# EAGLE design filterarduino (EAGLE 9.1.2)
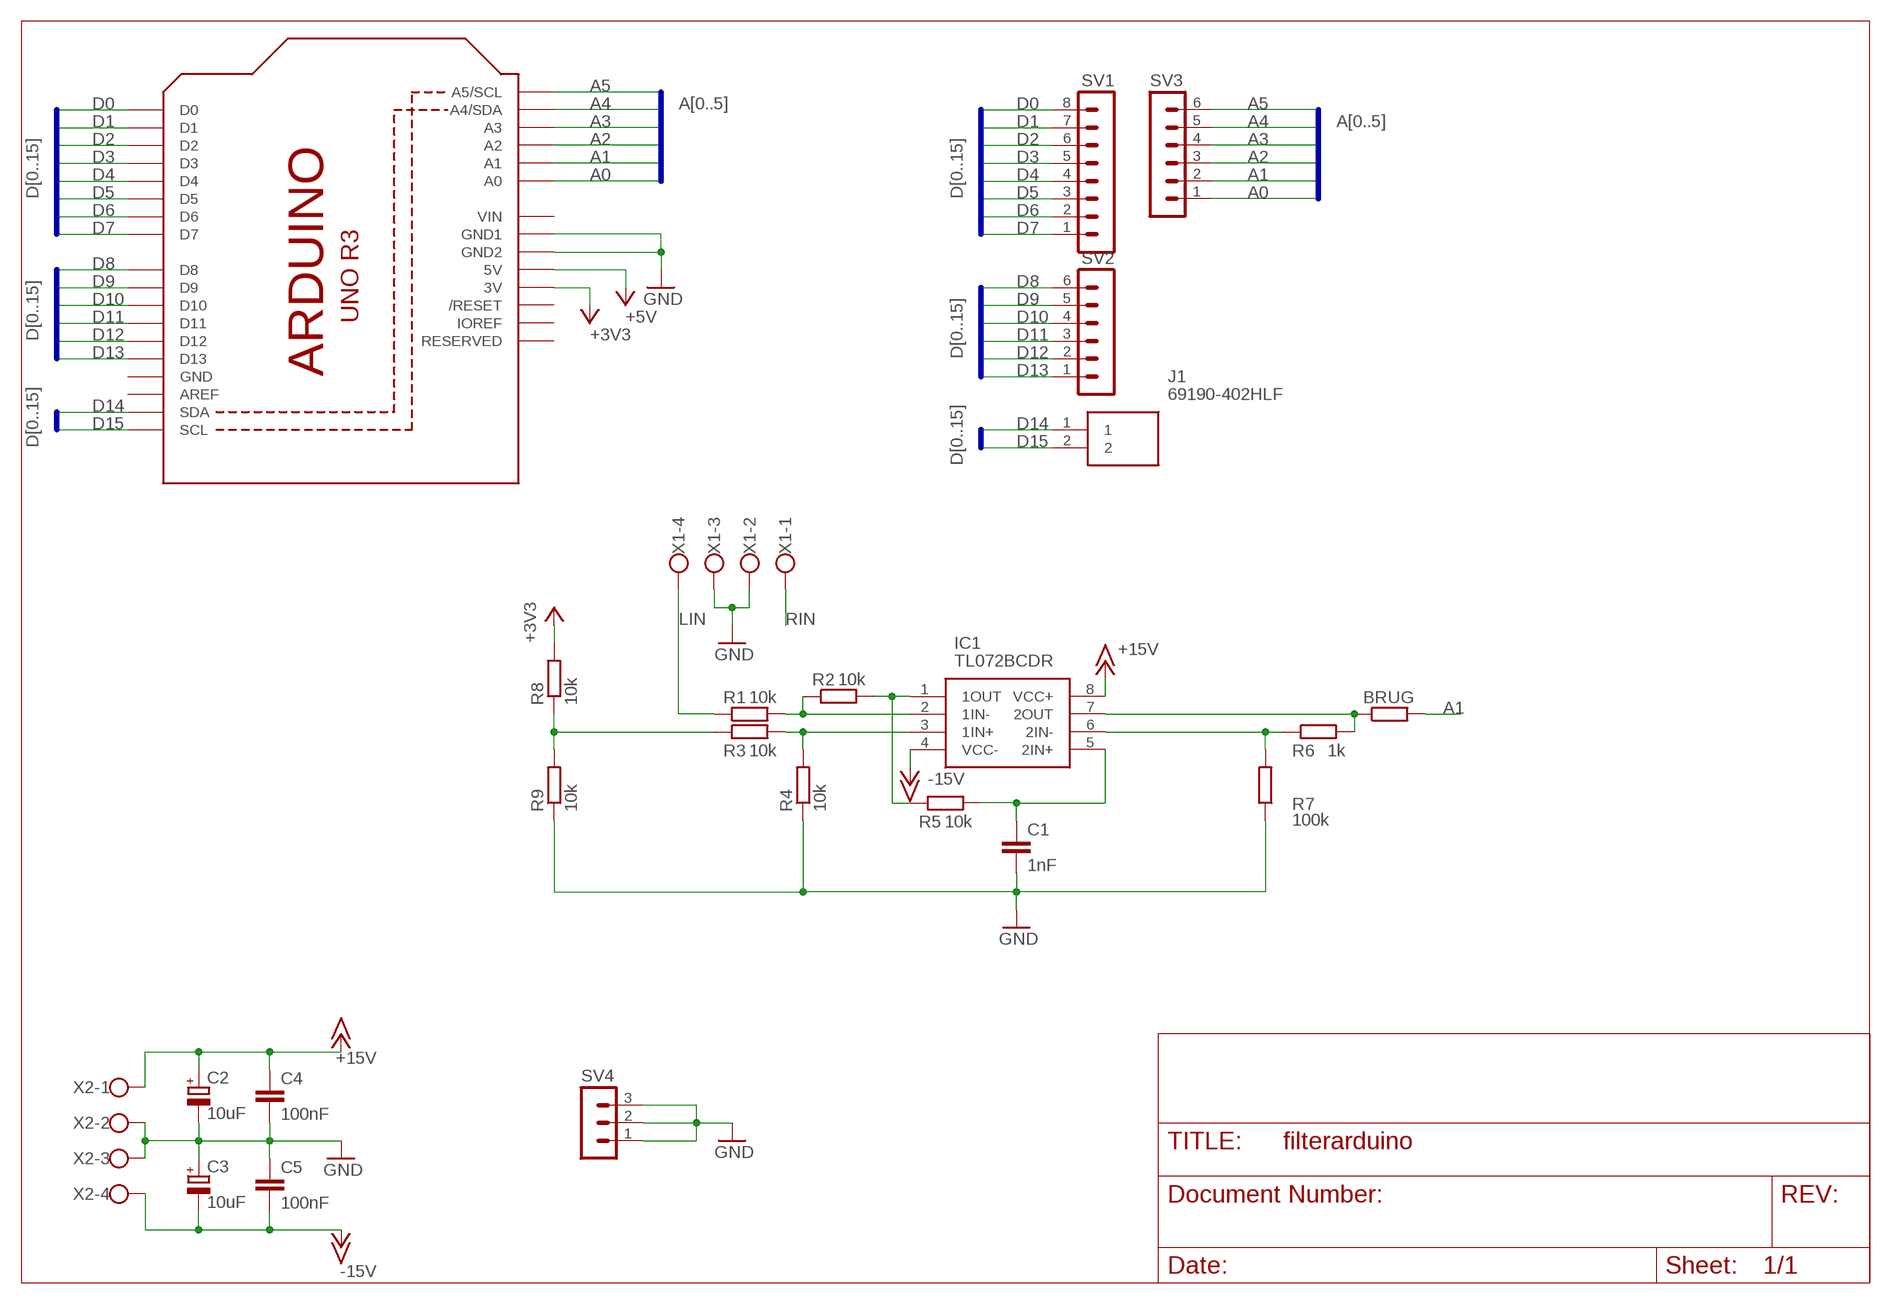
[diagram p0: schematic, sheet 1]

## Parts
BRUG  0  R-EU_R0805  [R0805]
C1  1nF  C-EUC0805  [C0805]
C2  10uF  CPOL-EU153CLV-0505  [153CLV-0505]
C3  10uF  CPOL-EU153CLV-0505  [153CLV-0505]
C4  100nF  C-EUC0805  [C0805]
C5  100nF  C-EUC0805  [C0805]
IC1  TL072BCDR  [SOIC127P600X175-8N]
J1  69190-402HLF  [HDRV2W90P0X254_1X2_508X241X858]
R1  10k  R-EU_R0805  [R0805]
R2  10k  R-EU_R0805  [R0805]
R3  10k  R-EU_R0805  [R0805]
R4  10k  R-EU_R0805  [R0805]
R5  10k  R-EU_R0805  [R0805]
R6  1k  R-EU_R0805  [R0805]
R7  100k  R-EU_R0805  [R0805]
R8  10k  R-EU_R0805  [R0805]
R9  10k  R-EU_R0805  [R0805]
SV1  MA08-1  [MA08-1]
SV2  MA06-1  [MA06-1]
SV3  MA06-1  [MA06-1]
SV4  MA03-1  [MA03-1]
U1  ARDUINOR3-BPLACE  [ARDUINOR3-BPLACE]
X1  W237-4  [W237-4]
X2  W237-4  [W237-4]

## Nets
+3V3: R8.2 U1.3V
+5V: U1.5V
+15V: C2.+ C4.1 IC1.8(VCC+) X2.1
-15V: C3.- C5.2 IC1.4(VCC-) X2.4
A0: SV3.1 U1.A0
A1: BRUG.2 SV3.2 U1.A1
A2: SV3.3 U1.A2
A3: SV3.4 U1.A3
A4: SV3.5 U1.A4(A4/SDA)
A5: SV3.6 U1.A5(A5/SCL)
D0: SV1.8 U1.D0
D1: SV1.7 U1.D1
D2: SV1.6 U1.D2
D3: SV1.5 U1.D3
D4: SV1.4 U1.D4
D5: SV1.3 U1.D5
D6: SV1.2 U1.D6
D7: SV1.1 U1.D7
D8: SV2.6 U1.D8
D9: SV2.5 U1.D9
D10: SV2.4 U1.D10
D11: SV2.3 U1.D11
D12: SV2.2 U1.D12
D13: SV2.1 U1.D13
D14: J1.1 U1.SDA
D15: J1.2 U1.SCL
GND: C1.2 C2.- C3.+ C4.2 C5.1 R4.1 R7.1 R9.1 SV4.1 SV4.2 SV4.3 U1.GND1 U1.GND2 X1.2 X1.3 X2.2 X2.3
LIN: R1.1 X1.4
N$1: IC1.2(1IN-) R1.2 R2.1
N$2: IC1.3(1IN+) R3.2 R4.2
N$3: IC1.1(1OUT) R2.2 R5.2
N$4: C1.1 IC1.5(2IN+) R5.1
N$5: BRUG.1 IC1.7(2OUT) R6.2
N$6: IC1.6(2IN-) R6.1 R7.2
N$9: R3.1 R8.1 R9.2
RIN: X1.1
Unconnected: U1.AREF U1.IOREF U1.RESERVED U1.RESET(/RESET)

## Buses
D[0..15]
A[0..5]

## Power pins joined to a net without a drawn wire
GND: U1.GND
VIN: U1.VIN

## Library data of the parts
BRUG R1-R9 = rcl-vito:R-EU_: RESISTOR, European symbol
C1 C4 C5 = rcl-vito:C-EU: CAPACITOR, European symbol
C2 C3 = rcl-vito:CPOL-EU: POLARIZED CAPACITOR, European symbol
IC1 = TL072BCDR:TL072BCDR: Dual low-noise JFET-input low offset operational amplifier Source: Datasheet <http://www.ti.com/lit/gpn/tl072b>; DESCRIPTION: Dual low-noise JFET-input low offset operational amplifier; HEIGHT: 1.75mm; MANUFACTURER_NAME: Texas Instruments; MANUFACTURER_PART_NUMBER: TL072BCDR; MOUSER_PART_NUMBER: 595-TL072BCDR; MOUSER_PRICE-STOCK: https://www.mouser.co.uk/ProductDetail/Texas-Instruments/TL072BCDR?qs=odmYgEirbwyOLHKvwmd6sw%3D%3D
J1 = 69190-402HLF:69190-402HLF: FCI,Header 2 way unshrouded FCI, Series Number 69190, 2.54mm Pitch 2 Way 1 Row Straight Header, Solder Termination Source: Datasheet <https://cdn.amphenol-icc.com/media/wysiwyg/files/drawing/69190.pdf>; ALLIED_NUMBER: 70302517; ALLIED_PRICE-STOCK: https://www.alliedelec.com/amphenol-fci-69190-402hlf/70302517/; ARROW_PART_NUMBER: 69190-402HLF; ARROW_PRICE-STOCK: https://www.arrow.com/en/products/69190-402hlf/amphenol-fci; DESCRIPTION: FCI,Header 2 way unshrouded FCI, Series Number 69190, 2.54mm Pitch 2 Way 1 Row Straight Header, Solder Termination; HEIGHT: 8.58mm; MANUFACTURER_NAME: FCI; MANUFACTURER_PART_NUMBER: 69190-402HLF; RS_PART_NUMBER: 8632731; RS_PRICE-STOCK: http://uk.rs-online.com/web/p/products/8632731
SV1 = con-lstb:MA08-1: PIN HEADER; OC_FARNELL: unknown; OC_NEWARK: unknown
SV2 SV3 = con-lstb:MA06-1: PIN HEADER; OC_FARNELL: unknown; OC_NEWARK: unknown
SV4 = con-lstb:MA03-1: PIN HEADER; OC_FARNELL: unknown; OC_NEWARK: unknown
U1 = adafruit:ARDUINOR3: This is a new object for the new Arduino R3 - with extra pins that you may want to use (such as IOref, and duplicated A4/A5
X1 X2 = con-wago-500:W237-4: WAGO SCREW CLAMP; OC_FARNELL: unknown; OC_NEWARK: unknown

## Board
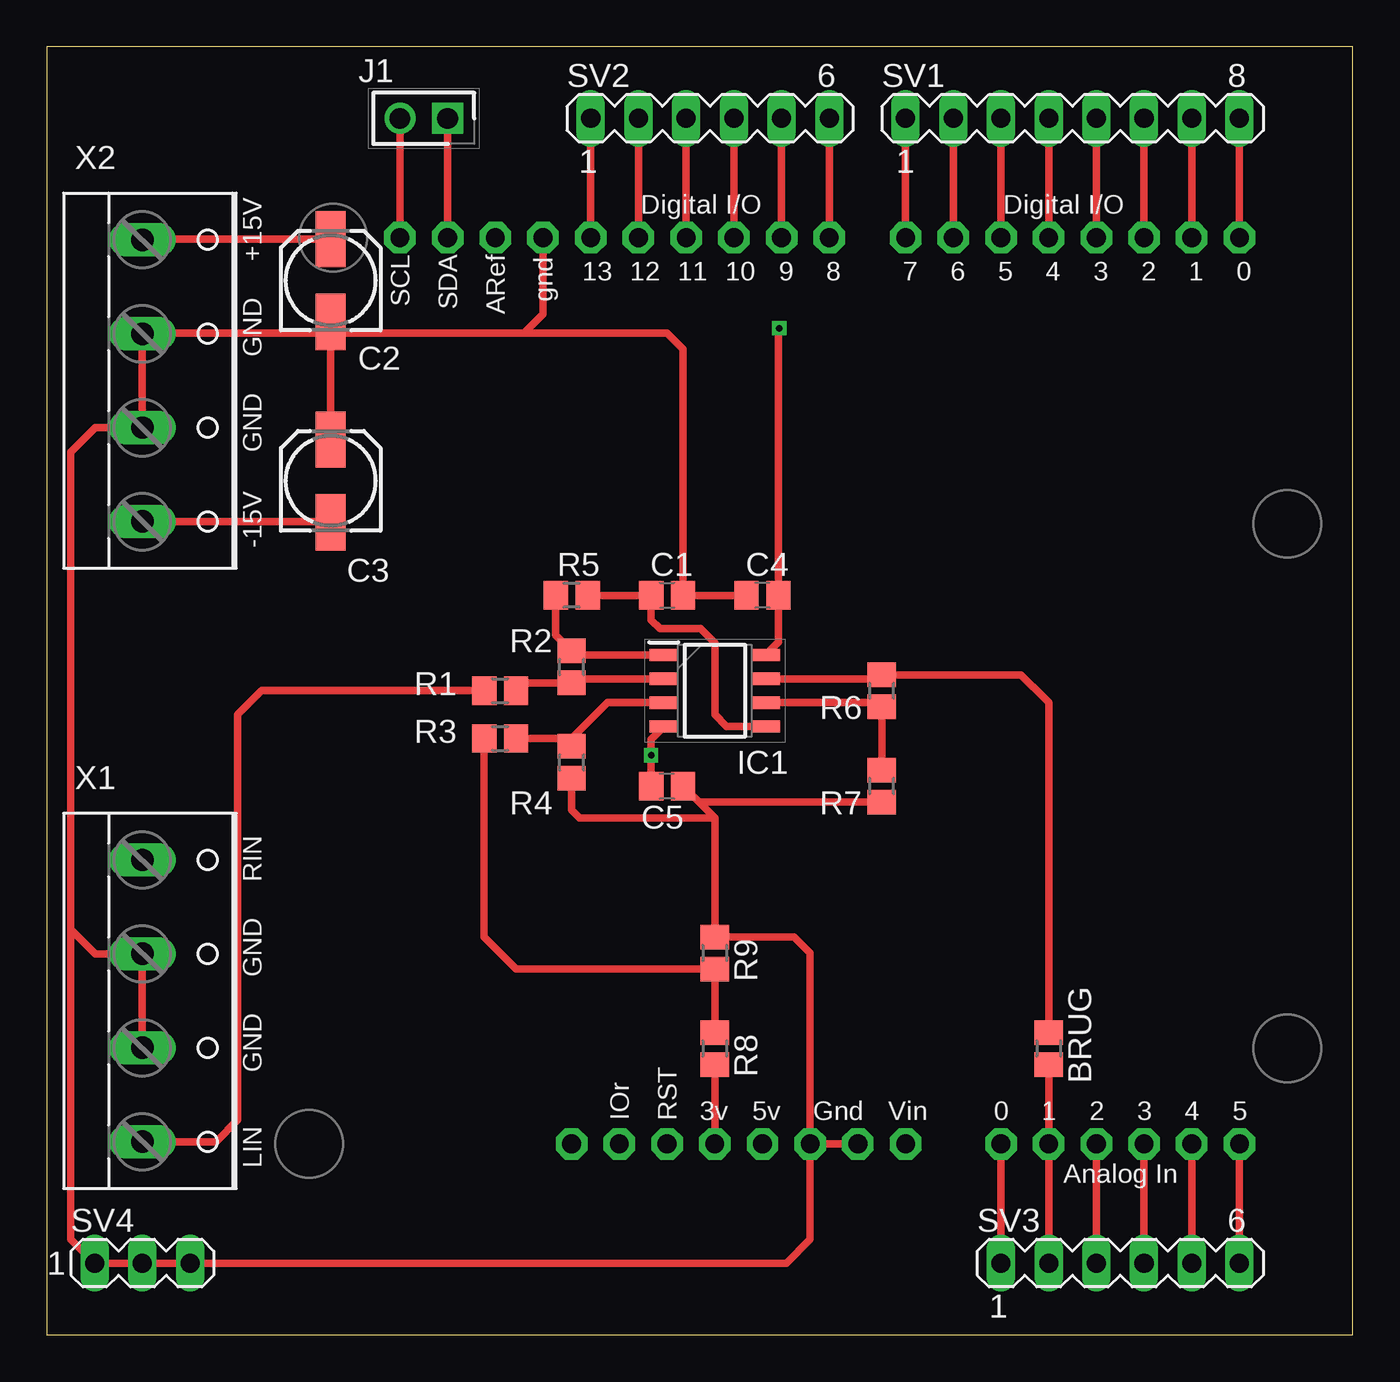
[diagram p1: board, top side]
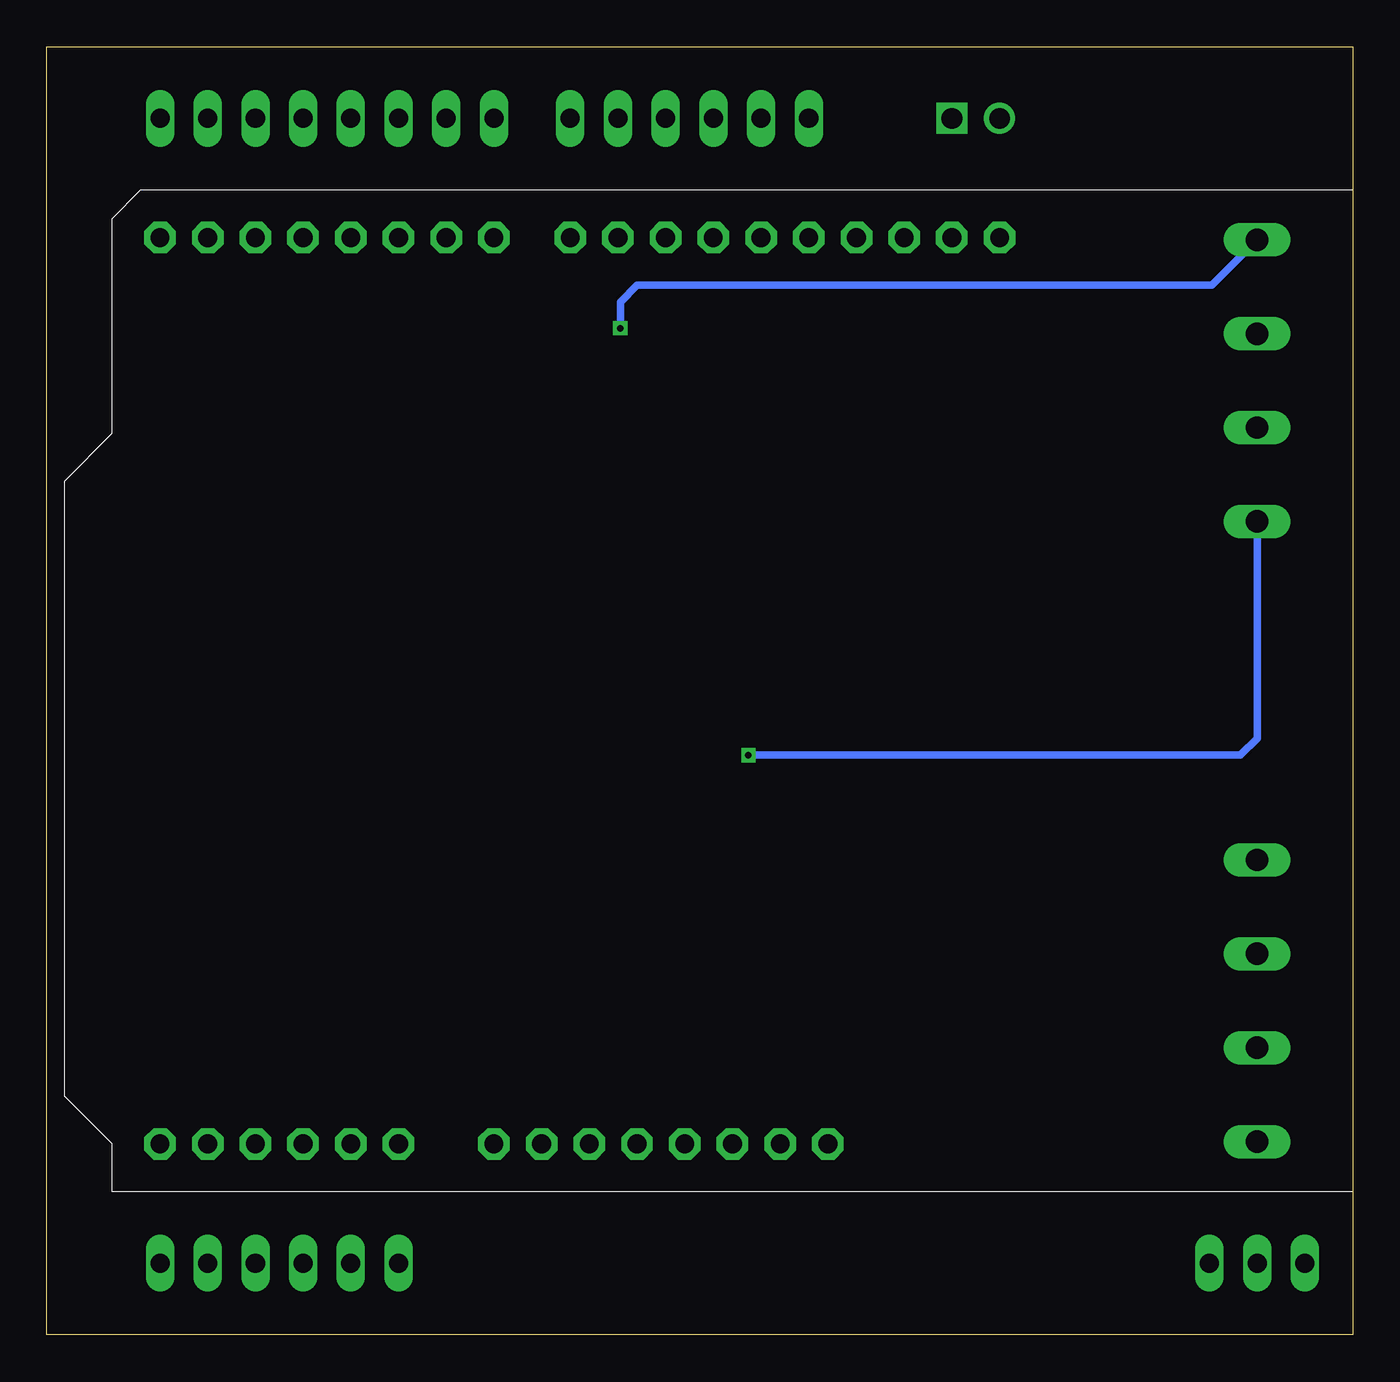
[diagram p2: board, bottom side, seen from below]

Size 69.52 x 68.57 mm. Coordinates in mm from the lower left corner, seen from the top.
Outline: 0,0 69.52,0 69.52,68.57 0,68.57 0,0
Copper layers (1*16): Top 0.035mm / dielectric 1.5mm / Bottom 0.035mm
Design rules "default": minimum track width 6mil, minimum drill 0.35mm, track to track 6mil, track to pad 6mil, pad to pad 6mil, via to via 6mil, smd to smd 6mil, copper to edge 40mil, drill to drill 6mil, minimum pad ring 10mil, minimum via ring 8mil, stop-mask expansion 4mil, vias tented up to drill 0mil, thermal gap 10mil

### Footprints (pad centres in the part's own frame; a part is rotated, then mirrored left to right if it is on the bottom)
R0805 = smd 1.3 x 1.5: 1 -0.85,0; 2 0.85,0
C0805 = smd 1.3 x 1.5: 1 -0.85,0; 2 0.85,0
153CLV-0505 = smd 3 x 1.6: + 2.2,0; - -2.2,0
SOIC127P600X175-8N = smd 1.528 x 0.65: 1 -2.711,1.905; 2 -2.711,0.635; 3 -2.711,-0.635; 4 -2.711,-1.905; 5 2.711,-1.905; 6 2.711,-0.635; 7 2.711,0.635; 8 2.711,1.905
HDRV2W90P0X254_1X2_508X241X858 = drill 1.1 pad 1.65 square: 1 0,0 | drill 1.1 pad 1.65: 2 2.54,0
MA08-1 = drill 1.016 long: 1 -8.89,0; 2 -6.35,0; 3 -3.81,0; 4 -1.27,0; 5 1.27,0; 6 3.81,0; 7 6.35,0; 8 8.89,0
MA06-1 = drill 1.016 long: 1 -6.35,0; 2 -3.81,0; 3 -1.27,0; 4 1.27,0; 5 3.81,0; 6 6.35,0
MA03-1 = drill 1.016 long: 1 -2.54,0; 2 0,0; 3 2.54,0
ARDUINOR3-BPLACE = drill 1 pad 1.676 octagon: 3V 35.56,2.54; 5V 38.1,2.54; A0 50.8,2.54; A1 53.34,2.54; A2 55.88,2.54; A3 58.42,2.54; A4 60.96,2.54; A5 63.5,2.54; AREF 23.876,50.8; D0 63.5,50.8; D1 60.96,50.8; D2 58.42,50.8; D3 55.88,50.8; D4 53.34,50.8; D5 50.8,50.8; D6 48.26,50.8; D7 45.72,50.8; D8 41.656,50.8; D9 39.116,50.8; D10 36.576,50.8; D11 34.036,50.8; D12 31.496,50.8; D13 28.956,50.8; GND 26.416,50.8; GND1 43.18,2.54; GND2 40.64,2.54; IOREF 30.48,2.54; RESERVED 27.94,2.54; RESET 33.02,2.54; SCL 18.796,50.8; SDA 21.336,50.8; VIN 45.72,2.54
W237-4 = drill 1.194 long: 1 -7.5,-1.27; 2 -2.5,-1.27; 3 2.5,-1.27; 4 7.5,-1.27

### Placement (x,y rotation side)
BRUG  53.34,15.24 270 top
C1  33.02,39.37 0 top
C2  15.11,56.13 90 top
C3  15.11,45.47 90 top
C4  38.1,39.37 180 top
C5  33.02,29.21 180 top
IC1  35.56,34.29 0 top
J1  21.34,64.77 180 top
R1  24.13,34.29 0 top
R2  27.94,35.56 90 top
R3  24.13,31.75 0 top
R4  27.94,30.48 90 top
R5  27.94,39.37 180 top
R6  44.45,34.29 90 top
R7  44.45,29.21 90 top
R8  35.56,15.24 270 top
R9  35.56,20.32 270 top
SV1  54.61,64.77 0 top
SV2  35.31,64.77 0 top
SV3  57.15,3.81 0 top
SV4  5.08,3.81 0 top
U1  0,7.62 0 top
X1  6.35,17.78 270 top
X2  6.35,50.8 270 top

### Tracks (layer width: path | path; a pad name or v marks a point on that pad's centre or on a via)
+3V3
  Top 0.406: R8.2 U1.3V
+15V  (via drill 0.35)
  Top 0.406: IC1.8 38.95,36.87 C4.1 38.95,53.55 v38.99,53.59 | C2.+ 5.17,58.33 5.08,58.42 X2.1
  Bottom 0.406: X2.1 7.5,55.88 38.1,55.88 38.99,54.99 v38.99,53.59
-15V  (via drill 0.35)
  Top 0.406: IC1.4 32.17,31.71 v32.17,30.86 C5.2 | X2.4 15.08,43.3 C3.-
  Bottom 0.406: v32.17,30.86 5.97,30.86 5.08,31.75 X2.4
A0
  Top 0.406: SV3.1 U1.A0
A1
  Top 0.406: BRUG.2 U1.A1 SV3.2
A2
  Top 0.406: U1.A2 SV3.3
A3
  Top 0.406: U1.A3 SV3.4
A4
  Top 0.406: U1.A4 SV3.5
A5
  Top 0.406: U1.A5 SV3.6
D0
  Top 0.406: SV1.8 U1.D0
D1
  Top 0.406: SV1.7 U1.D1
D2
  Top 0.406: SV1.6 U1.D2
D3
  Top 0.406: SV1.5 U1.D3
D4
  Top 0.406: SV1.4 U1.D4
D5
  Top 0.406: SV1.3 U1.D5
D6
  Top 0.406: SV1.2 U1.D6
D7
  Top 0.406: SV1.1 U1.D7
D8
  Top 0.406: SV2.6 U1.D8
D9
  Top 0.406: U1.D9 SV2.5
D10
  Top 0.406: SV2.4 U1.D10
D11
  Top 0.406: SV2.3 U1.D11
D12
  Top 0.406: SV2.2 U1.D12
D13
  Top 0.406: SV2.1 U1.D13
D14
  Top 0.406: J1.1 U1.SDA
D15
  Top 0.406: J1.2 U1.SCL
GND
  Top 0.152: C3.+ 15.11,48.26 15.11,53.34 | 15.11,53.34 C2.- | 15.24,53.34 15.11,53.34
  Top 0.406: C4.2 C1.2 33.87,52.49 33.02,53.34 25.4,53.34 | C5.1 34.72,28.36 | 34.72,28.36 R7.1 | 35.56,27.52 R9.1 39.79,21.17 40.64,20.32 U1.GND2 | 35.56,27.52 34.72,28.36 | 35.56,27.52 28.36,27.52 27.94,27.94 R4.1 | U1.GND2 U1.GND1 | X2.2 5.12,53.34 15.24,53.34 25.4,53.34 | X2.2 X2.3 2.58,48.3 1.27,46.99 1.27,21.59 | X2.2 5.08,53.34 X2.2 | C2.- 15.11,48.26 | U1.GND 26.42,54.36 25.4,53.34 | X1.3 X1.2 2.58,20.28 1.27,21.59 | 1.27,21.59 1.27,5.08 SV4.1 SV4.2 SV4.3 39.37,3.81 40.64,5.08 U1.GND2
LIN
  Top 0.406: X1.4 9.01,10.28 10.16,11.43 10.16,33.02 11.43,34.29 R1.1
N$1
  Top 0.406: IC1.2 28.16,34.93 R2.1 25.4,34.71 R1.2
N$2
  Top 0.406: R3.2 27.52,31.75 R4.2 27.94,31.75 29.84,33.66 IC1.3
N$3
  Top 0.406: IC1.1 28.16,36.2 R2.2 27.09,37.26 R5.2
N$4
  Top 0.406: R5.1 C1.1 32.17,38.06 32.64,37.59 34.8,37.59 35.56,36.83 35.56,33.02 36.2,32.39 IC1.5
N$5
  Top 0.406: BRUG.1 53.34,33.66 53.02,33.97 | 53.02,33.97 52.07,34.93 | 53.02,33.97 51.85,35.14 R6.2 44.23,34.93 IC1.7
N$6
  Top 0.406: IC1.6 44.23,33.66 R6.1 R7.2
N$9
  Top 0.406: R3.1 23.28,21.17 24.98,19.47 R9.2 R8.1

### Text on the board
tNames: +15V | GND | GND | -15V | RIN | GND | GND | LIN